# EasyEDA Pro project MiniWitch-Hardware.eprj

# Schematic MiniWitch

## Sheets
1 P1: Create Date: 2023-06-11; Page Name: P1; Project Name: MiniWitch-Hardware; Schematic Name: MiniWitch; Update Date: 2023-06-12; Company: 嘉立创EDA; Drawed: 野指针; Page Size: A4; Version: V1.0
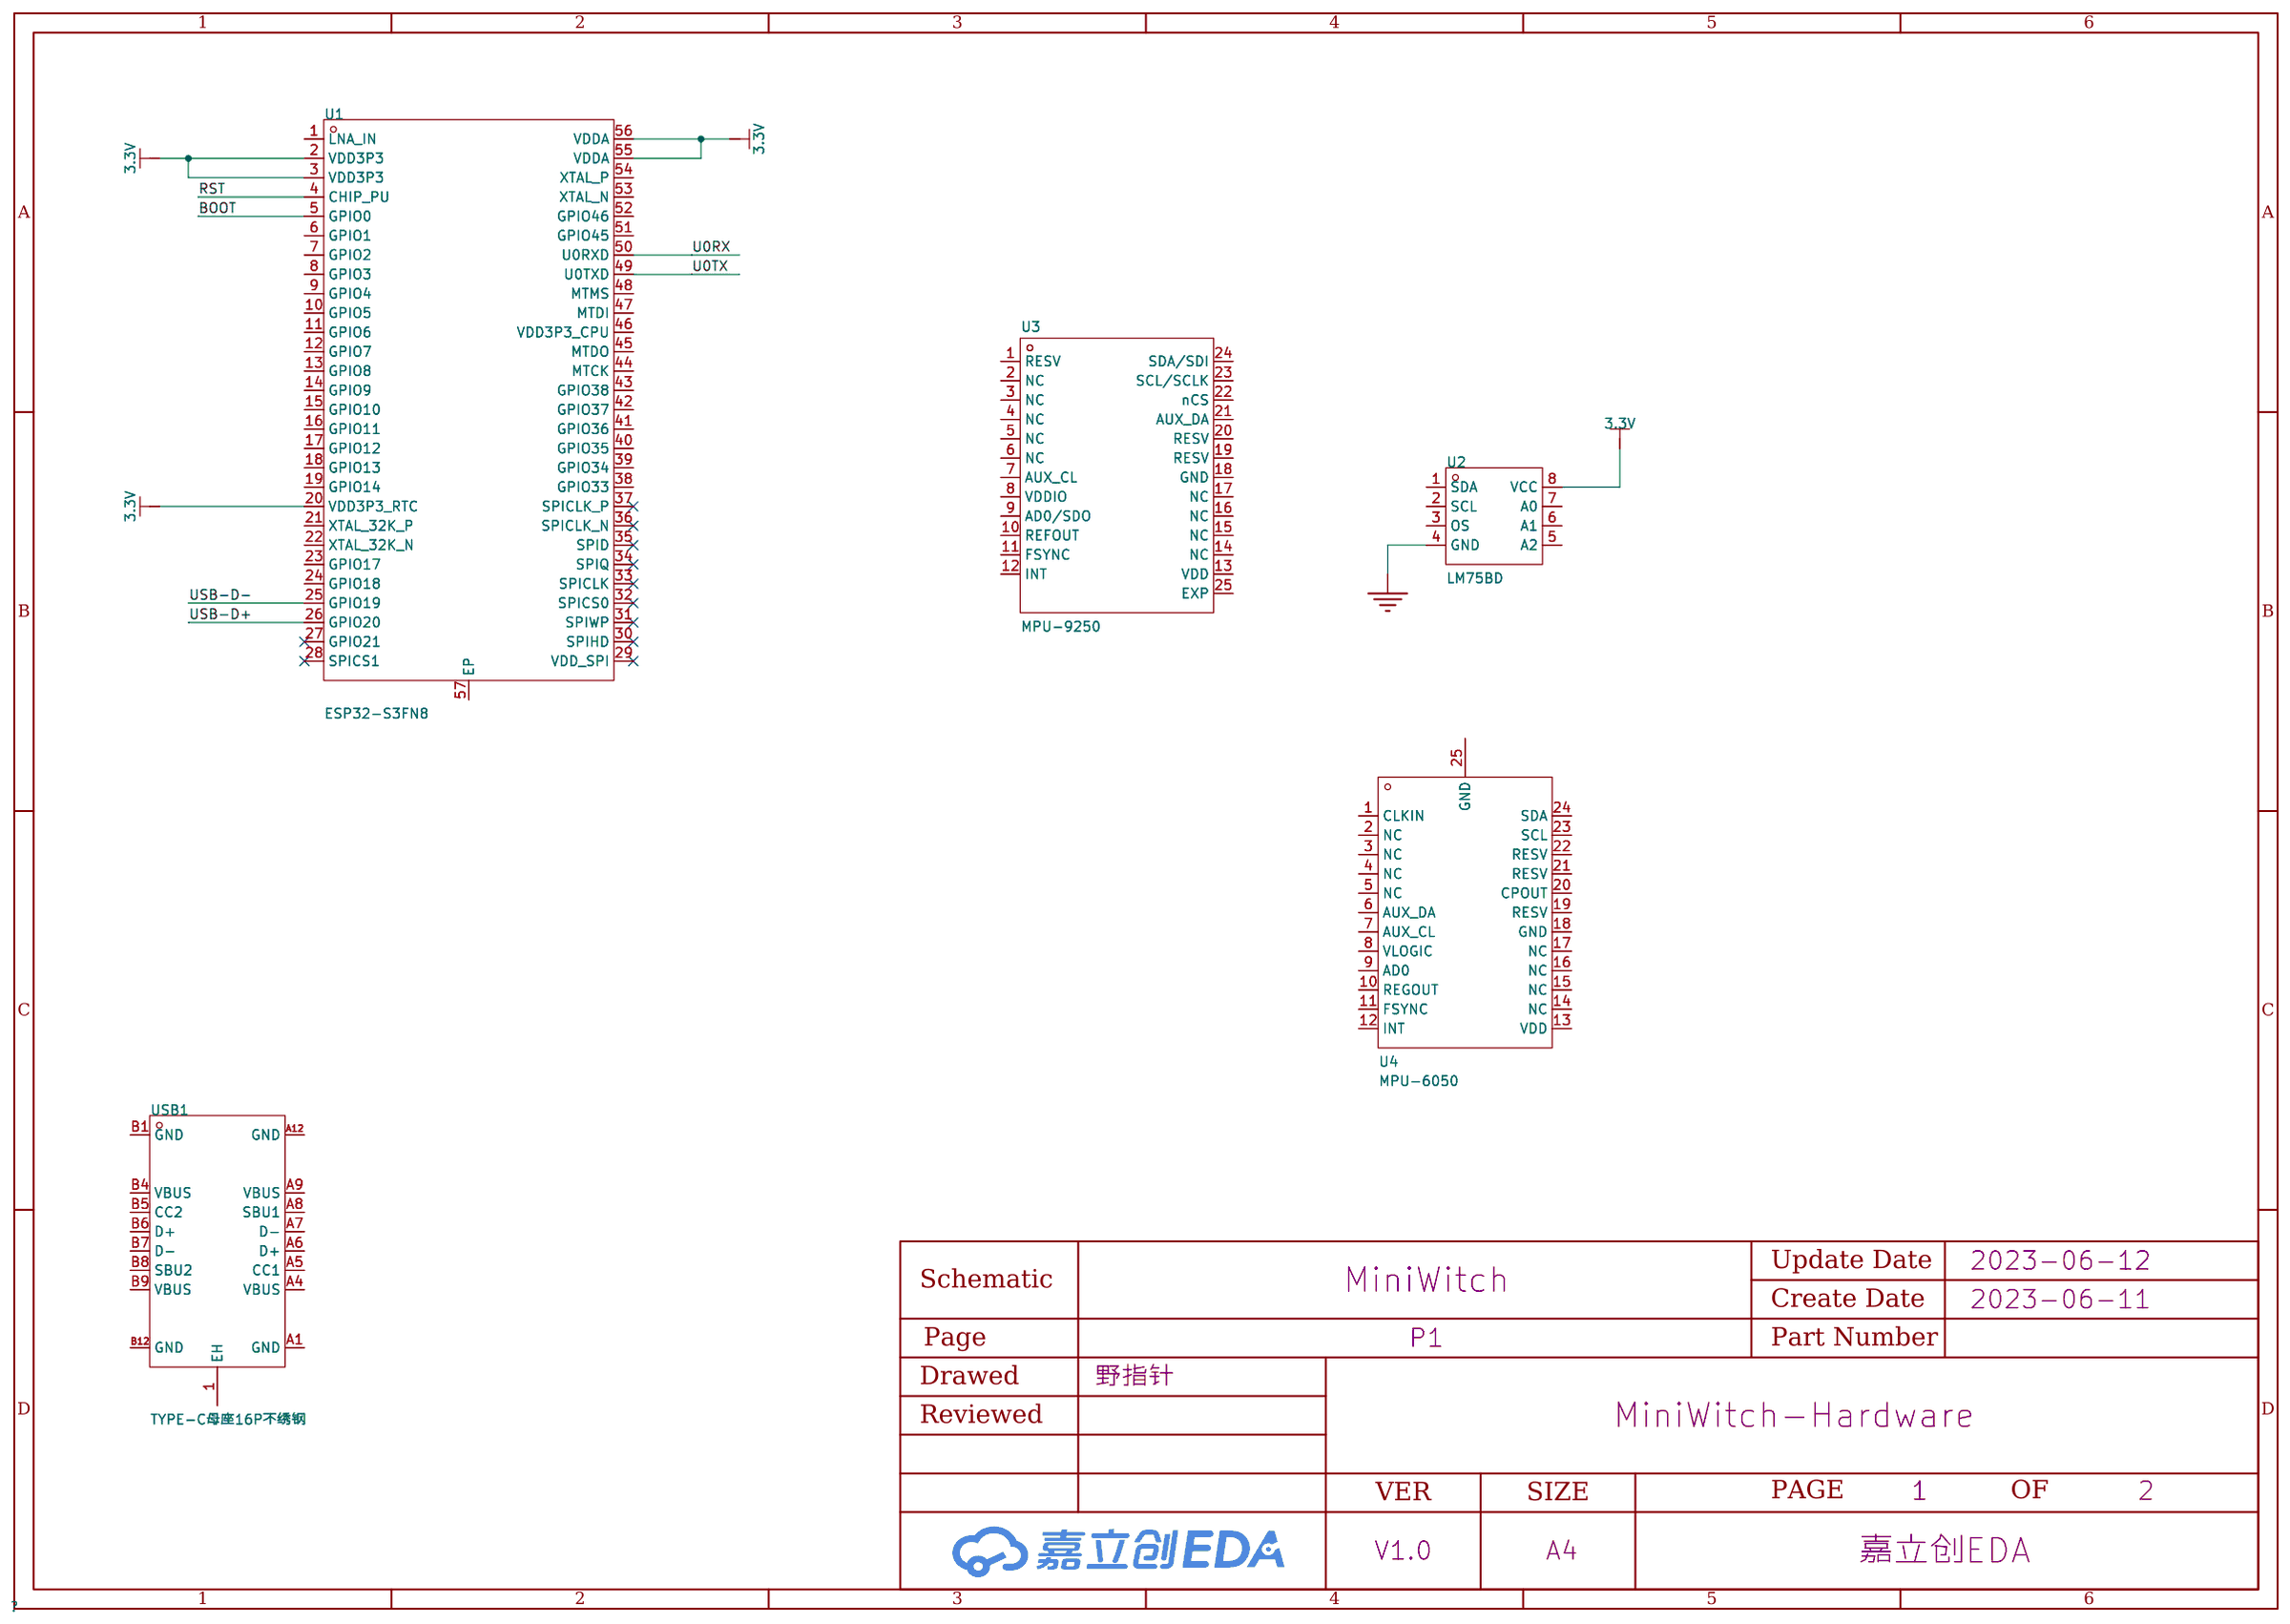
[diagram p0: P1]
2 P2: Create Date: 2023-06-12; Page Name: P2
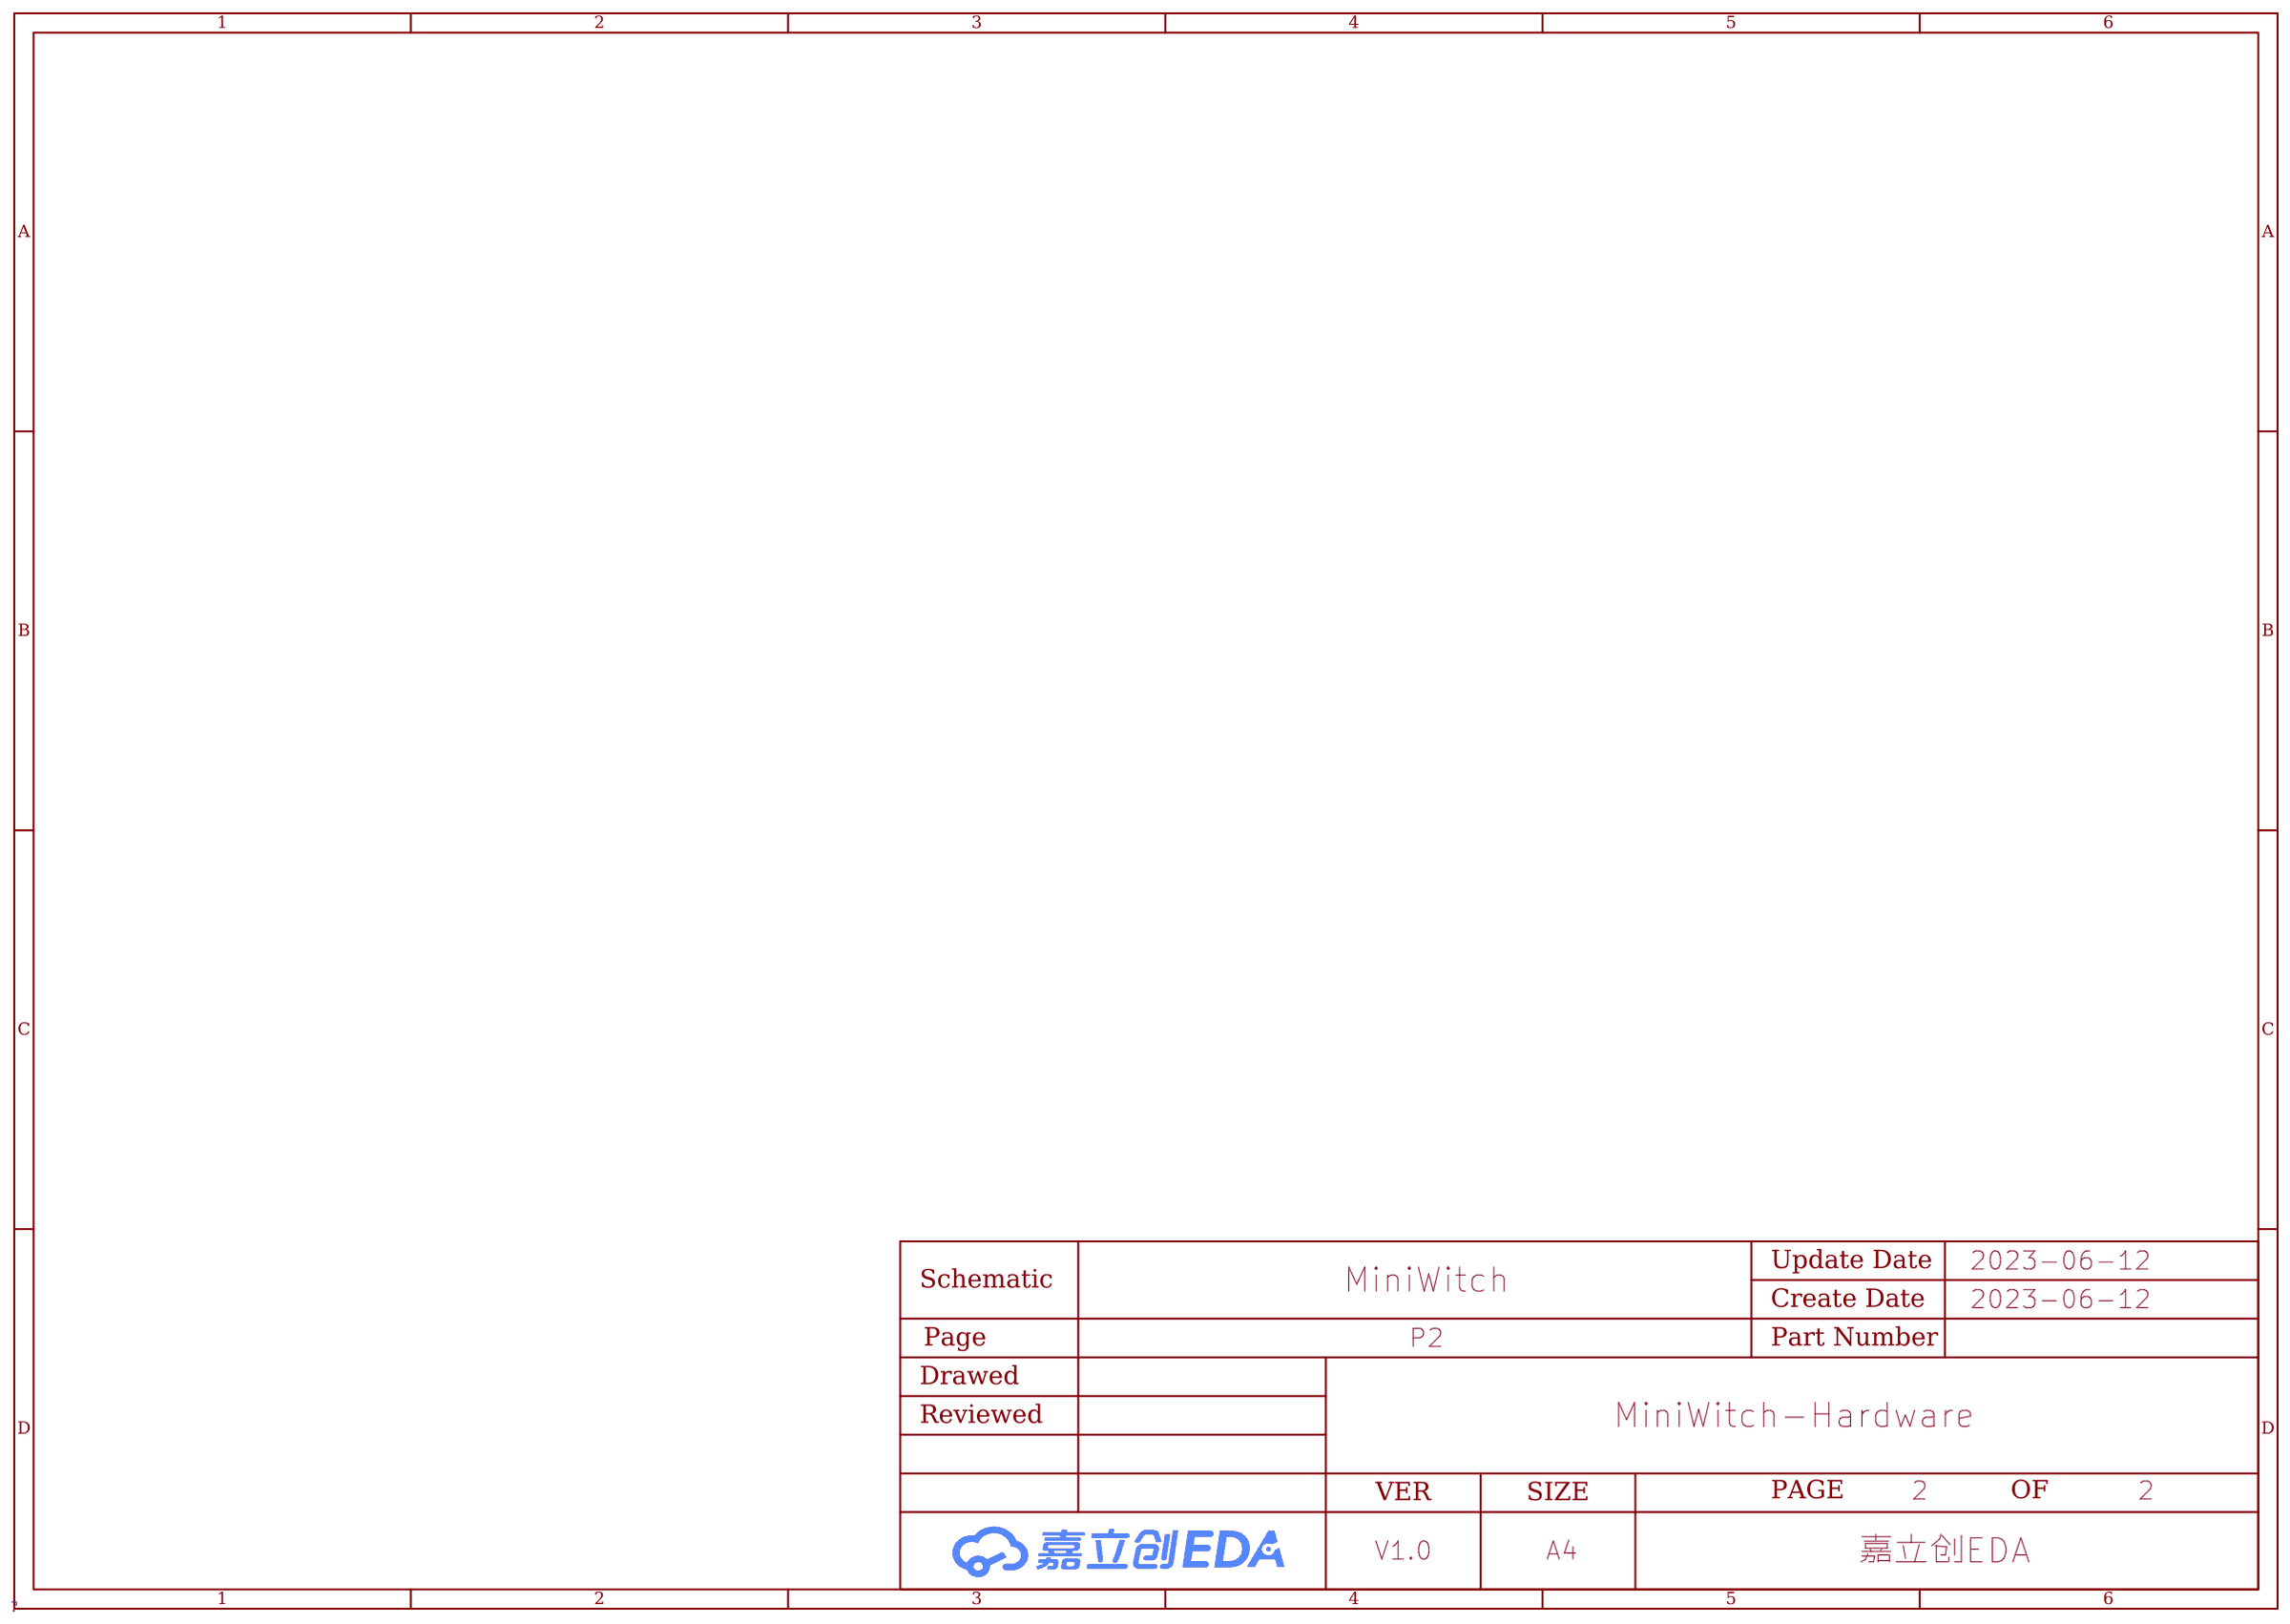
[diagram p1: P2]

## Parts
U1  ESP32-S3FN8  [QFN-56_L7.0-W7.0-P0.40-TL-EP4.0]
U2  LM75BD  [SOIC-8_L4.9-W3.9-P1.27-LS6.0-BL]
U3  MPU-9250  [QFN-24_L3.0-W3.0-P0.40-BL-EP]
U4  MPU-6050  [QFN-24_L4.0-W4.0-P0.50-BL-EP2.7]
USB1  TYPE-C母座16P不绣钢  [TYPE-C-SMD_16P-EH4]

## Library data of the parts
U1 = ESP32-S3: LCSC Part Name: 支持2.4GHz WIFI和低功耗蓝牙的MCU SoC; Supplier Part: C2913192; Manufacturer: ESPRESSIF(乐鑫); Supplier Footprint: QFN-56-EP(7x7); JLCPCB Part Class: Extended Part; Datasheet: https://atta.szlcsc.com/upload/public/pdf/source/20220211/8CA5C1C53CA8E3D1871752073201D38A.pdf; Supplier: LCSC
U2 = LM75BD: Supplier Part: C725792; Manufacturer: UMW(友台半导体); Supplier Footprint: SOP-8; JLCPCB Part Class: Extended Part; Datasheet: https://atta.szlcsc.com/upload/public/pdf/source/20200819/C725792_F95A8AEEAB8C4A7442D26B0F78B8D386.pdf; Supplier: LCSC
U3 = MPU-9250: 9轴传感器; LCSC Part Name: MPU-9250 停产; Supplier Part: C71459; Manufacturer: TDK InvenSense(应美盛); Supplier Footprint: QFN-24-EP(3x3); JLCPCB Part Class: Extended Part; Datasheet: https://atta.szlcsc.com/upload/public/pdf/source/20170810/C71459_1502335389644879978.pdf; Supplier: LCSC
U4 = MPU-6050: 三轴加速度计和三轴陀螺仪，工作电压：2.375V~3.46V; Supplier Part: C24112; Manufacturer: TDK InvenSense(应美盛); Supplier Footprint: QFN-24(4x4); JLCPCB Part Class: Basic Part; Datasheet: https://atta.szlcsc.com/upload/public/pdf/source/20140425/1457707046159.pdf; Supplier: LCSC
USB1 = TYPE-C母座16P不绣钢: Supplier Part: C9900003726; Supplier Footprint: TYPE-C-SMD_16P-L8.94-W7.35-P0.50; JLCPCB Part Class: Extended Part; Datasheet: 2021-12-11/843889W/dd391419263d492395079c07e7c227a9/SMDTYPEC16P.pdf; Supplier: LCSC

## Nets
3.3V: U1.2(VDD3P3) U1.3(VDD3P3) U1.20(VDD3P3_RTC) U1.55(VDDA) U1.56(VDDA) U2.8(VCC)
GND: U2.4(GND)
BOOT: U1.5(GPIO0)
RST: U1.4(CHIP_PU)
U0RX: U1.50(U0RXD)
U0TX: U1.49(U0TXD)
USB-D+: U1.26(GPIO20)
USB-D-: U1.25(GPIO19)

Not connected (* = marked no-connect by the designer): U1 1(LNA_IN) 6(GPIO1) 7(GPIO2) 8(GPIO3) 9(GPIO4) 10(GPIO5) 11(GPIO6) 12(GPIO7) 13(GPIO8) 14(GPIO9) 15(GPIO10) 16(GPIO11) 17(GPIO12) 18(GPIO13) 19(GPIO14) 21(XTAL_32K_P) 22(XTAL_32K_N) 23(GPIO17) 24(GPIO18) 27(GPIO21)* 28(SPICS1)* 29(VDD_SPI)* 30(SPIHD)* 31(SPIWP)* 32(SPICS0)* 33(SPICLK)* 34(SPIQ)* 35(SPID)* 36(SPICLK_N)* 37(SPICLK_P)* 38(GPIO33) 39(GPIO34) 40(GPIO35) 41(GPIO36) 42(GPIO37) 43(GPIO38) 44(MTCK) 45(MTDO) 46(VDD3P3_CPU) 47(MTDI) 48(MTMS) 51(GPIO45) 52(GPIO46) 53(XTAL_N) 54(XTAL_P) 57(EP); U2 1(SDA) 2(SCL) 3(OS) 5(A2) 6(A1) 7(A0); U3 1(RESV) 2(NC) 3(NC) 4(NC) 5(NC) 6(NC) 7(AUX_CL) 8(VDDIO) 9(AD0/SDO) 10(REFOUT) 11(FSYNC) 12(INT) 13(VDD) 14(NC) 15(NC) 16(NC) 17(NC) 18(GND) 19(RESV) 20(RESV) 21(AUX_DA) 22(nCS) 23(SCL/SCLK) 24(SDA/SDI) 25(EXP); U4 1(CLKIN) 2(NC) 3(NC) 4(NC) 5(NC) 6(AUX_DA) 7(AUX_CL) 8(VLOGIC) 9(AD0) 10(REGOUT) 11(FSYNC) 12(INT) 13(VDD) 14(NC) 15(NC) 16(NC) 17(NC) 18(GND) 19(RESV) 20(CPOUT) 21(RESV) 22(RESV) 23(SCL) 24(SDA) 25(GND); USB1 1(EH) A1(GND) A4(VBUS) A5(CC1) A6(D+) A7(D-) A8(SBU1) A9(VBUS) A12(GND) B1(GND) B4(VBUS) B5(CC2) B6(D+) B7(D-) B8(SBU2) B9(VBUS) B12(GND)
